# Altium schematic sheet cd_switching.SchDoc: Power Side
size A3; SheetNumber: 1; SheetTotal: 6
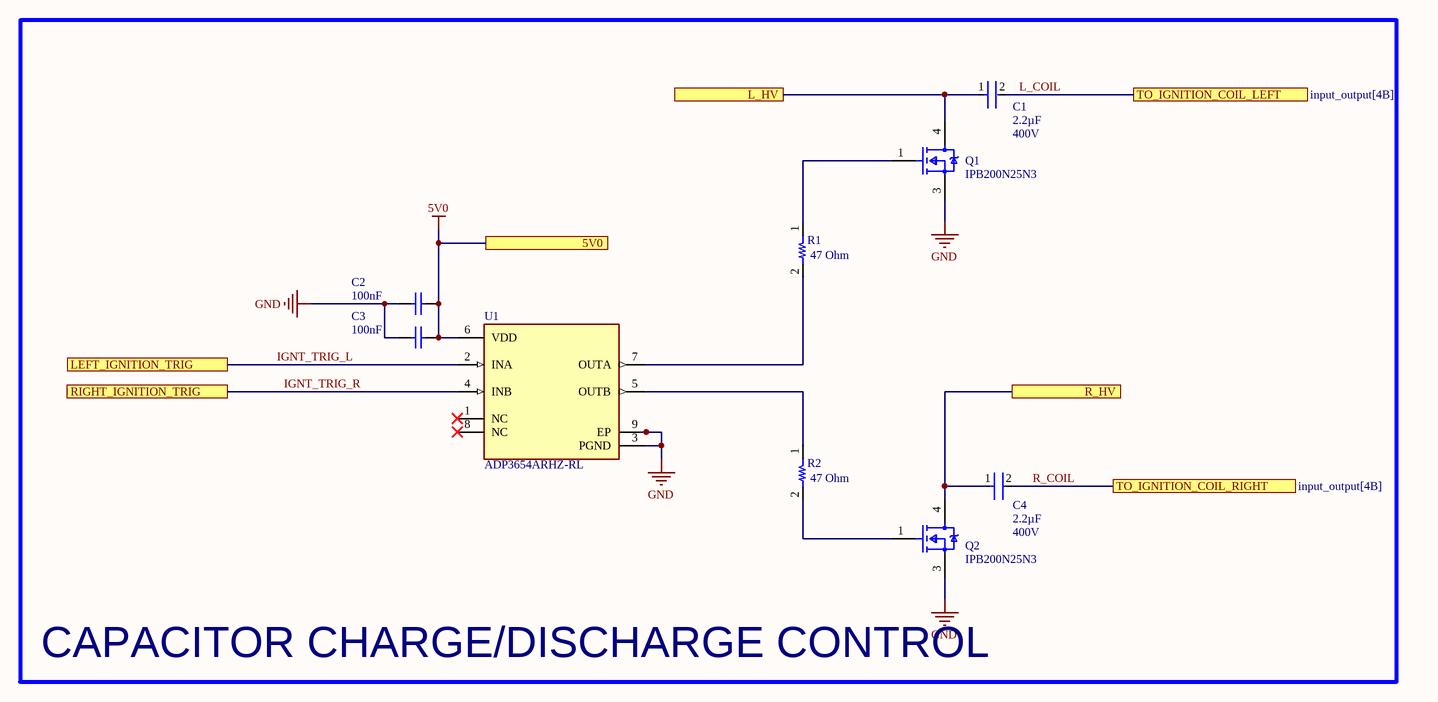
[diagram p0: cd_switching.SchDoc]

## Parts
C1  Voltage Rating (AC): 400V  Capacitance: 2.2µF  [FP-BFC233820225-MFG]  (hidden comment: BFC233820225)
C2  value 100nF  [CAPC1608X90X35LL15T15]  (hidden comment: 06035C104KAT4A)
C3  value 100nF  [CAPC1608X87X35NL15T15]  (hidden comment: C0603C475K8PACTU)
C4  Voltage Rating (AC): 400V  Capacitance: 2.2µF  [FP-BFC233820225-MFG]  (hidden comment: BFC233820225)
Q1  IPB200N25N3  [FP-PG-TO252-3-MFG]
Q2  IPB200N25N3  [FP-PG-TO252-3-MFG]
R1  value 47 Ohm  [0603_FP]  (hidden comment: Resistor_0603)
R2  value 47 Ohm  [0603_FP]  (hidden comment: Resistor_0603)
U1  ADP3654ARHZ-RL  [FP-RH-8-1-IPC_C]

## Blocks framed on the sheet
CAPACITOR CHARGE/DISCHARGE CONTROL: C1-C4 Q1 Q2 R1 R2 U1

## Ports
5V0 (see LV_power[3B]), L_HV (see HV_power[4A]), LEFT_IGNITION_TRIG (see logic[1A]), R_HV (see HV_power[4B]), RIGHT_IGNITION_TRIG (see logic[1B]), TO_IGNITION_COIL_LEFT (see input_output[4B]), TO_IGNITION_COIL_RIGHT (see input_output[4B])

## Nets
5V0: C2.1 C3.2 U1.6(VDD) ; port 5V0
GND: C2.2 C3.1 Q1.3(SOURCE) Q2.3(SOURCE) U1.3(PGND) U1.9(EP)
IGNT_TRIG_L: U1.2(INA) ; port LEFT_IGNITION_TRIG
IGNT_TRIG_R: U1.4(INB) ; port RIGHT_IGNITION_TRIG
L_COIL: C1.2 ; port TO_IGNITION_COIL_LEFT
L_HV: C1.1 Q1.4(DRAIN) ; port L_HV
R_COIL: C4.2 ; port TO_IGNITION_COIL_RIGHT
R_HV: C4.1 Q2.4(DRAIN) ; port R_HV
NetQ1_1: Q1.1(GATE) R1.1
NetQ2_1: Q2.1(GATE) R2.2
NetR1_2: R1.2 U1.7(OUTA)
NetR2_1: R2.1 U1.5(OUTB)

Not connected (* = marked no-connect by the designer): U1 1(NC)* 8(NC)*

## Library data of the parts
C1 C4 = CMP-00030-39758189-1: BFC233820225 Film Capacitor, Polypropylene, 800V, 20% +Tol, 20% -Tol, 0.22uF, Through Hole Mount; Insulation Resistance: 11GΩ; Lead Diameter: 800µm; Voltage Rating (DC): 630V; Dielectric: PP; Packaging: Bulk; Lead Pitch: 27.5mm; Number of Pins: 2; Contact Plating: Tin; Height - Seated (Max): 24.9936mm; Width: 15.0114mm; Min Operating Temperature: -55°C; Lead Free: Lead Free; Length: 31.5mm; Schedule B: 8532250020, 8532250020; Depth: 15mm; NexarPartId: 39758189; Max Operating Temperature: 110°C; Tolerance: 20%; Dielectric Material: PP; RoHS: Compliant; Height: 28mm; Case/Package: Radial; Diameter: 18mm; Termination: Radial; Voltage Rating: 630V; REACH SVHC: Unknown; Radiation Hardening: No; Mount: Through Hole
C2 = CMP-2006-04390-1: Manufacturer: AVX Interconnect / Elco; Part Number: 06035C104KAT4A
C3 = CMP-2006-03238-1: Manufacturer: Kemet; Part Number: C0603C475K8PACTU
Q1 Q2 = CMP-32901-000143-1: MOSFET N-CH 30V 161A DPAK; Manufacturer Part Number: IRLR7843TRPBF; Manufacturer: Infineon; Drain To Source Resistance: 3.2mΩ; Depletion Mode: False; Reverse Recovery Time: 39ns; Reverse Recovery Charge: 36nC; Threshold Vgs Max: 2.3V; Rthja Max: 50°C/W; Threshold Vgs Min: 1.4V; Power Dissipation: 140W; Pulse Drain Current: 620A; Input Capacitace At Vds: 4380pF @ 15V; Turn On Delay Time: 25ns; Gate To Source Voltage: 20V; Max Forward Diode Voltage: 1V; Gate Charge At Vgs: 34nC @ 4.5V; Max Junction Temp: +175°C; Number Of Channels: 1; Turn Off Delay Time: 34ns; ComponentLink2URL: https://www.infineon.com/dgdl/irlr7843pbf.pdf?fileId=5546d462533600a40153566de53526d8; Temperature Range High: +175°C; Octopart: https://octopart.com/irlr7843trpbf-infineon-65875062; Temperature: -55°C to +175°C; Device Class L3: MOSFETs; Category: Trans; Package: PG-TO252-3; Footprint Url: https://www.infineon.com/cms/en/product/packages/PG-TO252/PG-TO252-3-901/; Continuous Drain Current: 161A; Digikey Description: MOSFET N-CH 30V 161A DPAK; Automotive: No; Lead Free: Yes; Drain To Source Breakdown Voltage: 30V; Height: 2.52mm; Temperature Range Low: -55°C; RoHS: TRUE; Number Of N Channels: 1; Drain To Source Voltage: 30V; ComponentLink2Description: Datasheet; Device Class L2: Transistors; Device Class L1: Discrete Semiconductors
R1 R2 = Resistor_0603: Format: 0402; Package: 0402
U1 = CMP-09133-000023-1: IC GATE DRVR LOW-SIDE 8MINISOIC; Number of Outputs: 2; Min Supply Voltage: 4.5V; Output Current: 4A; Max Supply Current: 3mA; Rise Time: 14ns; Fall Time: 25ns; Max Supply Voltage: 18V; Turn-On Delay Time: 35ns; Channel Type: Independent; Package Quantity: 3000; RoHS Compliant: Yes; Series: -; Max Operating Temperature: 125°C; Mount: Surface Mount; Max Output Current: 4A; Lead Free: Contains Lead; Supply Current: 3mA; Packaging: Tape and Reel; Case/Package: MSOP; Min Operating Temperature: -40°C; Min Input Voltage: 4.5V; Max Input Voltage: 18V; Number of Drivers: 2; Nominal Supply Current: 3mA; Number of Pins: 8; Propagation Delay: 35ns